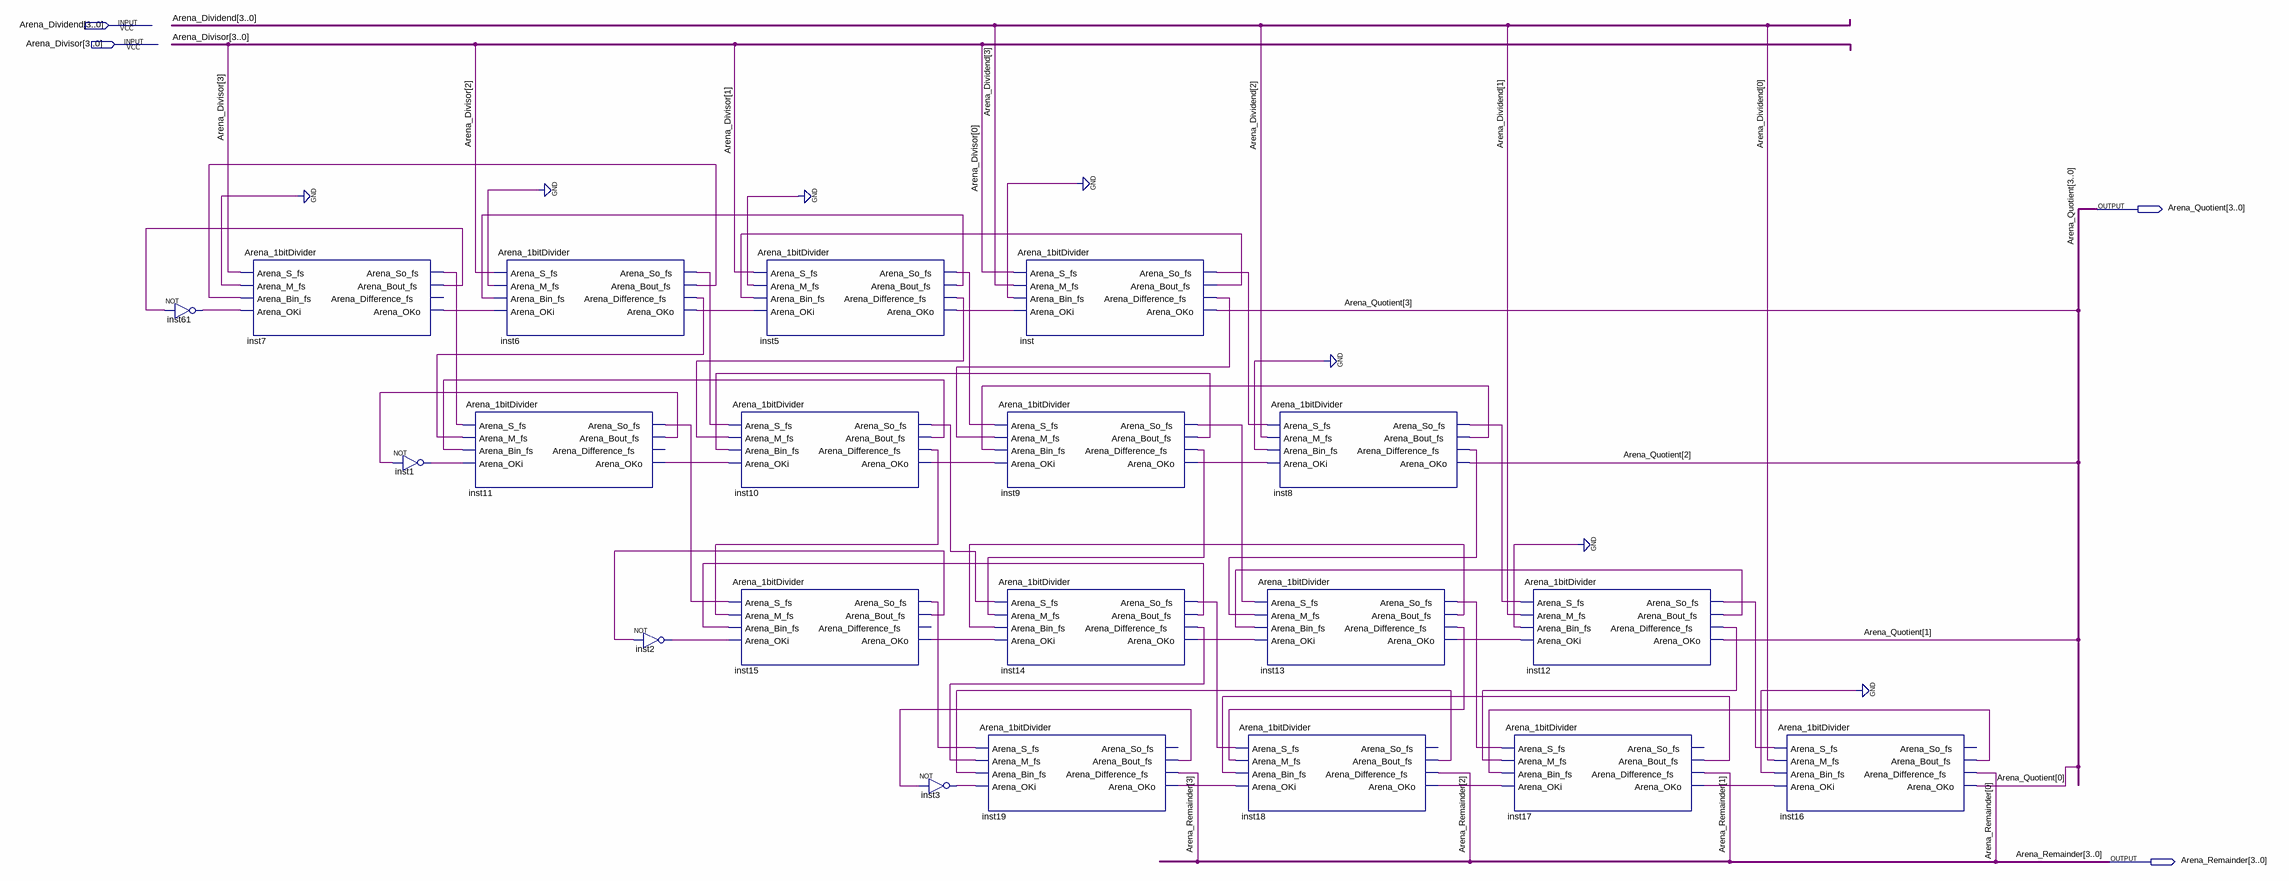
[diagram p0: schematic sheet]
// Quartus schematic Arena_4bit_divider.bdf as structural Verilog: 20 symbols, 4 pins
module Arena_4bit_divider (
  input  [3:0] Arena_Dividend,
  input  [3:0] Arena_Divisor,
  output [3:0] Arena_Quotient,
  output [3:0] Arena_Remainder
);

  wire inst1_out, inst2_out, inst3_out, inst5_arena_bout_fs, inst5_arena_difference_fs, inst5_arena_oko,
       inst5_arena_so_fs, inst6_arena_bout_fs, inst6_arena_difference_fs, inst6_arena_oko, inst6_arena_so_fs,
       inst7_arena_bout_fs, inst7_arena_oko, inst7_arena_so_fs, inst8_arena_bout_fs,
       inst8_arena_difference_fs, inst8_arena_so_fs, inst9_arena_bout_fs, inst9_arena_difference_fs,
       inst9_arena_oko, inst9_arena_so_fs, inst10_arena_bout_fs, inst10_arena_difference_fs,
       inst10_arena_oko, inst10_arena_so_fs, inst11_arena_bout_fs, inst11_arena_oko, inst11_arena_so_fs,
       inst12_arena_bout_fs, inst12_arena_difference_fs, inst12_arena_so_fs, inst13_arena_bout_fs,
       inst13_arena_difference_fs, inst13_arena_oko, inst13_arena_so_fs, inst14_arena_bout_fs,
       inst14_arena_difference_fs, inst14_arena_oko, inst14_arena_so_fs, inst15_arena_bout_fs,
       inst15_arena_oko, inst15_arena_so_fs, inst16_arena_bout_fs, inst17_arena_bout_fs, inst17_arena_oko,
       inst18_arena_bout_fs, inst18_arena_oko, inst19_arena_bout_fs, inst19_arena_oko, inst61_out,
       inst_arena_bout_fs, inst_arena_difference_fs, inst_arena_so_fs;

  not inst61 (inst61_out, inst7_arena_bout_fs);
  Arena_1bitDivider inst7 (
    .Arena_S_fs(Arena_Divisor[3]), .Arena_M_fs(1'b0), .Arena_Bin_fs(inst6_arena_bout_fs),
    .Arena_OKi(inst61_out), .Arena_So_fs(inst7_arena_so_fs), .Arena_Bout_fs(inst7_arena_bout_fs),
    .Arena_OKo(inst7_arena_oko));  // open: Arena_Difference_fs
  not inst1 (inst1_out, inst11_arena_bout_fs);
  Arena_1bitDivider inst6 (
    .Arena_S_fs(Arena_Divisor[2]), .Arena_M_fs(1'b0), .Arena_Bin_fs(inst5_arena_bout_fs),
    .Arena_OKi(inst7_arena_oko), .Arena_So_fs(inst6_arena_so_fs), .Arena_Bout_fs(inst6_arena_bout_fs),
    .Arena_Difference_fs(inst6_arena_difference_fs), .Arena_OKo(inst6_arena_oko));
  Arena_1bitDivider inst11 (
    .Arena_S_fs(inst7_arena_so_fs), .Arena_M_fs(inst6_arena_difference_fs),
    .Arena_Bin_fs(inst10_arena_bout_fs), .Arena_OKi(inst1_out), .Arena_So_fs(inst11_arena_so_fs),
    .Arena_Bout_fs(inst11_arena_bout_fs), .Arena_OKo(inst11_arena_oko));  // open: Arena_Difference_fs
  not inst2 (inst2_out, inst15_arena_bout_fs);
  Arena_1bitDivider inst5 (
    .Arena_S_fs(Arena_Divisor[1]), .Arena_M_fs(1'b0), .Arena_Bin_fs(inst_arena_bout_fs),
    .Arena_OKi(inst6_arena_oko), .Arena_So_fs(inst5_arena_so_fs), .Arena_Bout_fs(inst5_arena_bout_fs),
    .Arena_Difference_fs(inst5_arena_difference_fs), .Arena_OKo(inst5_arena_oko));
  Arena_1bitDivider inst10 (
    .Arena_S_fs(inst6_arena_so_fs), .Arena_M_fs(inst5_arena_difference_fs),
    .Arena_Bin_fs(inst9_arena_bout_fs), .Arena_OKi(inst11_arena_oko), .Arena_So_fs(inst10_arena_so_fs),
    .Arena_Bout_fs(inst10_arena_bout_fs), .Arena_Difference_fs(inst10_arena_difference_fs),
    .Arena_OKo(inst10_arena_oko));
  Arena_1bitDivider inst15 (
    .Arena_S_fs(inst11_arena_so_fs), .Arena_M_fs(inst10_arena_difference_fs),
    .Arena_Bin_fs(inst14_arena_bout_fs), .Arena_OKi(inst2_out), .Arena_So_fs(inst15_arena_so_fs),
    .Arena_Bout_fs(inst15_arena_bout_fs), .Arena_OKo(inst15_arena_oko));  // open: Arena_Difference_fs
  not inst3 (inst3_out, inst19_arena_bout_fs);
  Arena_1bitDivider inst (
    .Arena_S_fs(Arena_Divisor[0]), .Arena_M_fs(Arena_Dividend[3]), .Arena_Bin_fs(1'b0),
    .Arena_OKi(inst5_arena_oko), .Arena_So_fs(inst_arena_so_fs), .Arena_Bout_fs(inst_arena_bout_fs),
    .Arena_Difference_fs(inst_arena_difference_fs), .Arena_OKo(Arena_Quotient[3]));
  Arena_1bitDivider inst9 (
    .Arena_S_fs(inst5_arena_so_fs), .Arena_M_fs(inst_arena_difference_fs),
    .Arena_Bin_fs(inst8_arena_bout_fs), .Arena_OKi(inst10_arena_oko), .Arena_So_fs(inst9_arena_so_fs),
    .Arena_Bout_fs(inst9_arena_bout_fs), .Arena_Difference_fs(inst9_arena_difference_fs),
    .Arena_OKo(inst9_arena_oko));
  Arena_1bitDivider inst14 (
    .Arena_S_fs(inst10_arena_so_fs), .Arena_M_fs(inst9_arena_difference_fs),
    .Arena_Bin_fs(inst13_arena_bout_fs), .Arena_OKi(inst15_arena_oko), .Arena_So_fs(inst14_arena_so_fs),
    .Arena_Bout_fs(inst14_arena_bout_fs), .Arena_Difference_fs(inst14_arena_difference_fs),
    .Arena_OKo(inst14_arena_oko));
  Arena_1bitDivider inst19 (
    .Arena_S_fs(inst15_arena_so_fs), .Arena_M_fs(inst14_arena_difference_fs),
    .Arena_Bin_fs(inst18_arena_bout_fs), .Arena_OKi(inst3_out), .Arena_Bout_fs(inst19_arena_bout_fs),
    .Arena_Difference_fs(Arena_Remainder[3]), .Arena_OKo(inst19_arena_oko));  // open: Arena_So_fs
  Arena_1bitDivider inst8 (
    .Arena_S_fs(inst_arena_so_fs), .Arena_M_fs(Arena_Dividend[2]), .Arena_Bin_fs(1'b0),
    .Arena_OKi(inst9_arena_oko), .Arena_So_fs(inst8_arena_so_fs), .Arena_Bout_fs(inst8_arena_bout_fs),
    .Arena_Difference_fs(inst8_arena_difference_fs), .Arena_OKo(Arena_Quotient[2]));
  Arena_1bitDivider inst13 (
    .Arena_S_fs(inst9_arena_so_fs), .Arena_M_fs(inst8_arena_difference_fs),
    .Arena_Bin_fs(inst12_arena_bout_fs), .Arena_OKi(inst14_arena_oko), .Arena_So_fs(inst13_arena_so_fs),
    .Arena_Bout_fs(inst13_arena_bout_fs), .Arena_Difference_fs(inst13_arena_difference_fs),
    .Arena_OKo(inst13_arena_oko));
  Arena_1bitDivider inst18 (
    .Arena_S_fs(inst14_arena_so_fs), .Arena_M_fs(inst13_arena_difference_fs),
    .Arena_Bin_fs(inst17_arena_bout_fs), .Arena_OKi(inst19_arena_oko), .Arena_Bout_fs(inst18_arena_bout_fs),
    .Arena_Difference_fs(Arena_Remainder[2]), .Arena_OKo(inst18_arena_oko));  // open: Arena_So_fs
  Arena_1bitDivider inst12 (
    .Arena_S_fs(inst8_arena_so_fs), .Arena_M_fs(Arena_Dividend[1]), .Arena_Bin_fs(1'b0),
    .Arena_OKi(inst13_arena_oko), .Arena_So_fs(inst12_arena_so_fs), .Arena_Bout_fs(inst12_arena_bout_fs),
    .Arena_Difference_fs(inst12_arena_difference_fs), .Arena_OKo(Arena_Quotient[1]));
  Arena_1bitDivider inst17 (
    .Arena_S_fs(inst13_arena_so_fs), .Arena_M_fs(inst12_arena_difference_fs),
    .Arena_Bin_fs(inst16_arena_bout_fs), .Arena_OKi(inst18_arena_oko), .Arena_Bout_fs(inst17_arena_bout_fs),
    .Arena_Difference_fs(Arena_Remainder[1]), .Arena_OKo(inst17_arena_oko));  // open: Arena_So_fs
  Arena_1bitDivider inst16 (
    .Arena_S_fs(inst12_arena_so_fs), .Arena_M_fs(Arena_Dividend[0]), .Arena_Bin_fs(1'b0),
    .Arena_OKi(inst17_arena_oko), .Arena_Bout_fs(inst16_arena_bout_fs),
    .Arena_Difference_fs(Arena_Remainder[0]), .Arena_OKo(Arena_Quotient[0]));  // open: Arena_So_fs
endmodule
